# EAGLE design RPi_Keypad_Tester_01 (EAGLE 9.6.2)
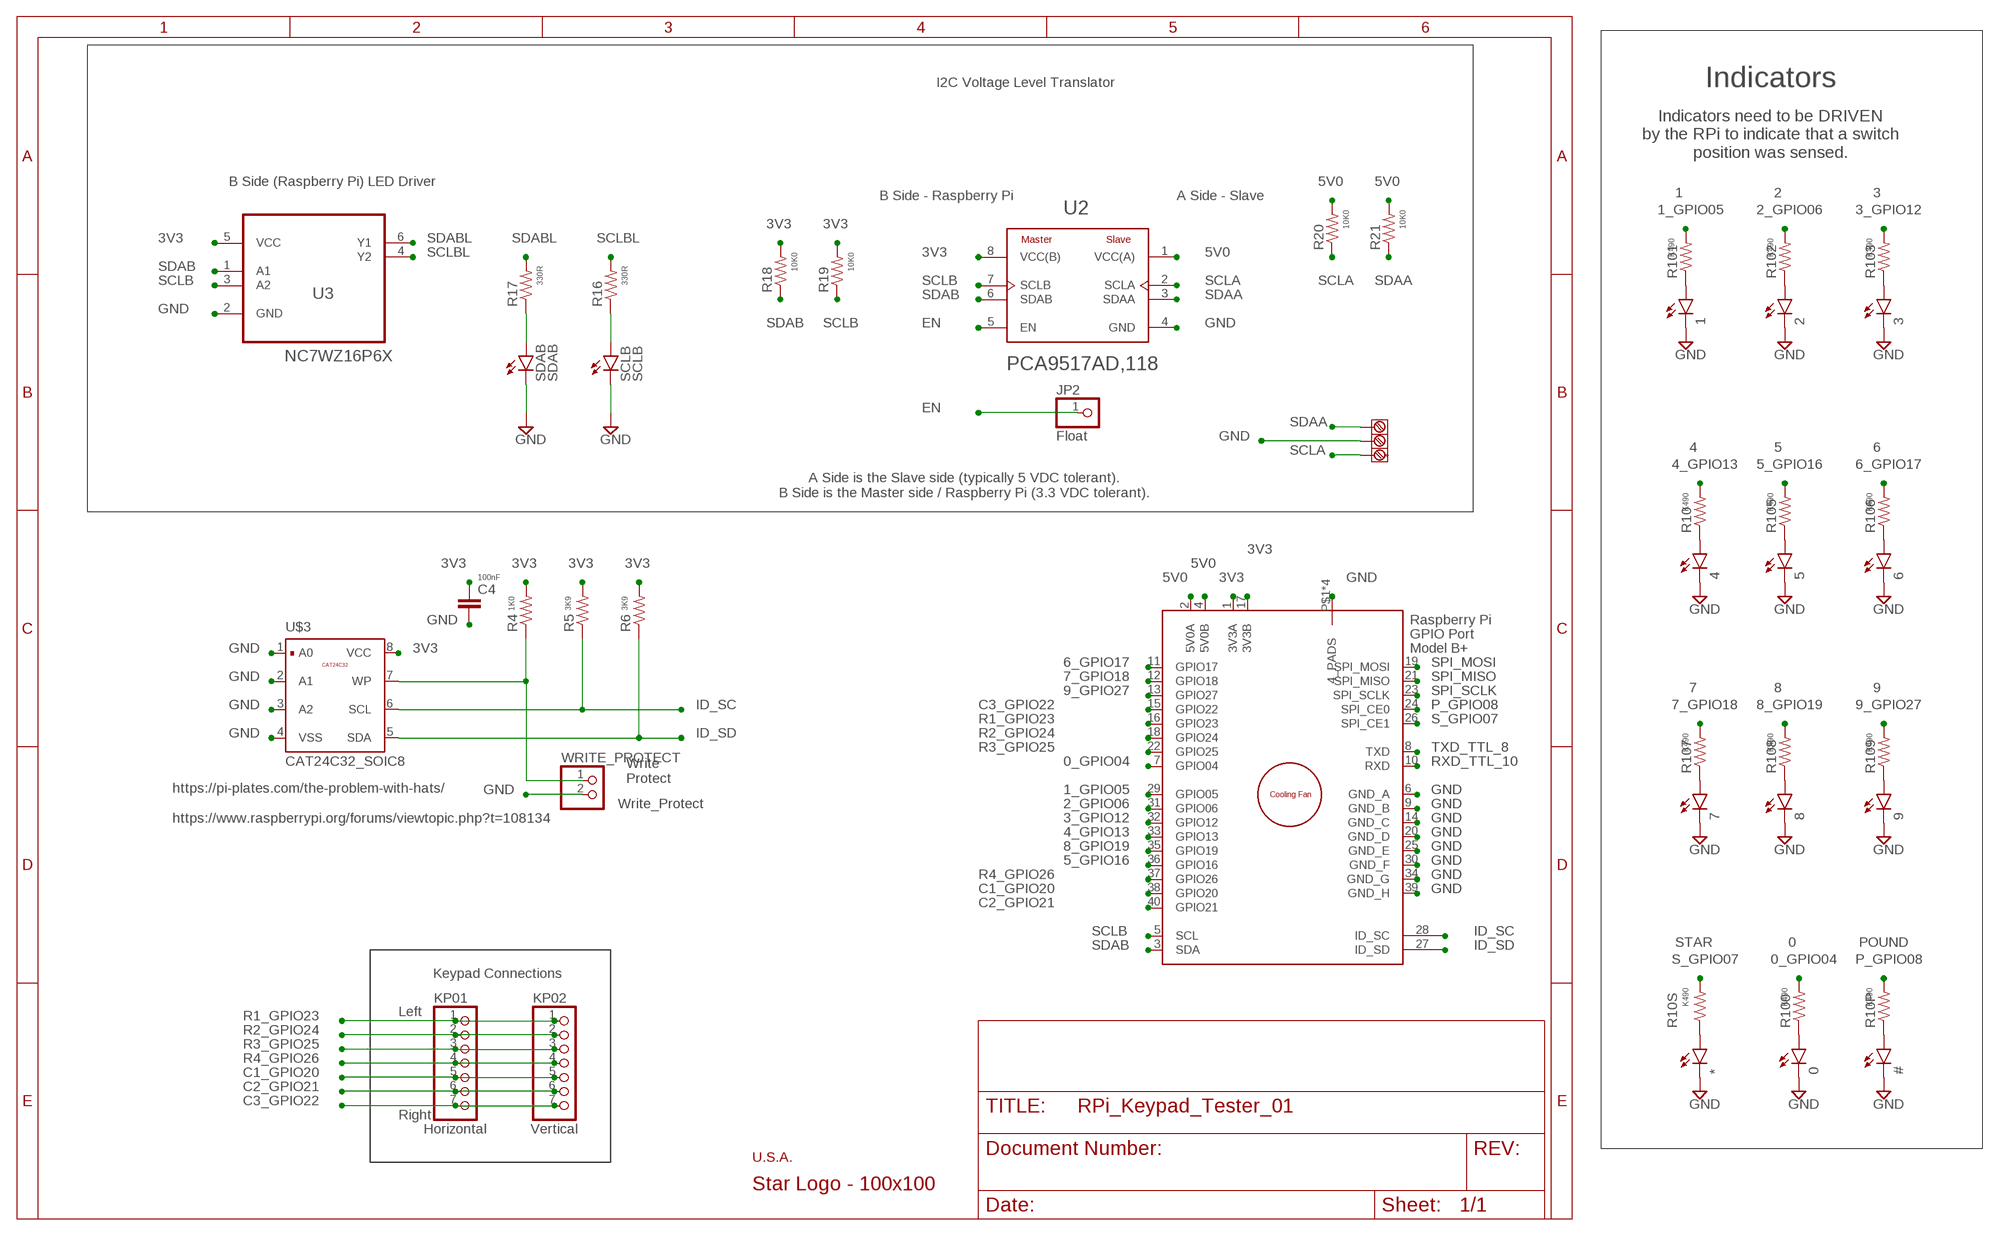
[diagram p0: schematic, sheet 1]

## Parts
0  0  LEDSML1206  [SML1206]
1  1  LEDSML1206  [SML1206]
2  2  LEDSML1206  [SML1206]
3  3  LEDSML1206  [SML1206]
4  4  LEDSML1206  [SML1206]
5  5  LEDSML1206  [SML1206]
6  6  LEDSML1206  [SML1206]
7  7  LEDSML1206  [SML1206]
8  8  LEDSML1206  [SML1206]
9  9  LEDSML1206  [SML1206]
#  POUND  LEDSML1206  [SML1206]
*  STAR  LEDSML1206  [SML1206]
C4  100nF  C0805C0805  [C0805]
JP2  Float  PINHD-1X1  [1X01]
KP01  PINHD-1X7/90  [1X07/90]
KP02  PINHD-1X7  [1X07]
R4  1K0  RESISTOR_1206_AC  [RES_1206]
R5  3K9  RESISTOR_1206_AC  [RES_1206]
R6  3K9  RESISTOR_1206_AC  [RES_1206]
R10  K490  RESISTOR_1206_AC  [RES_1206]
R10P  K490  RESISTOR_1206_AC  [RES_1206]
R10S  K490  RESISTOR_1206_AC  [RES_1206]
R16  330R  RESISTOR_1206_AC  [RES_1206]
R17  330R  RESISTOR_1206_AC  [RES_1206]
R18  10K0  RESISTOR_1206_AC  [RES_1206]
R19  10K0  RESISTOR_1206_AC  [RES_1206]
R20  10K0  RESISTOR_1206_AC  [RES_1206]
R21  10K0  RESISTOR_1206_AC  [RES_1206]
R100  K490  RESISTOR_1206_AC  [RES_1206]
R101  K490  RESISTOR_1206_AC  [RES_1206]
R102  K490  RESISTOR_1206_AC  [RES_1206]
R103  K490  RESISTOR_1206_AC  [RES_1206]
R105  K490  RESISTOR_1206_AC  [RES_1206]
R106  K490  RESISTOR_1206_AC  [RES_1206]
R107  K490  RESISTOR_1206_AC  [RES_1206]
R108  K490  RESISTOR_1206_AC  [RES_1206]
R109  K490  RESISTOR_1206_AC  [RES_1206]
SCLB  SCLB  LEDSML1206  [SML1206]
SDAB  SDAB  LEDSML1206  [SML1206]
U2  PCA9517AD,118  [SOIC127P600X175-8N]
U3  NC7WZ16P6X  [SOT65P210X110-6N]
U$1  USA_01  [USA_01]
U$2  3_POSITION_3.81  [3_POSITION_3.81]
U$3  CAT24C32_SOIC8  [CAT24C32_SOIC8]
U$4  STAR_LOGO_01  [STAR_LOGO_01]
WRITE_PROTECT  Write_Protect  PINHD-1X2  [1X02]
X1  RASPI_BOARD_B+#2_HDC  [RASPI_BOARD_B+HAT_DF_CF]

## Nets
0_GPIO04: R100.2 X1.7(GPIO04)
1_GPIO05: R101.2 X1.29(GPIO05)
2_GPIO06: R102.2 X1.31(GPIO06)
3_GPIO12: R103.2 X1.32(GPIO12)
3V3: C4.1 R4.2 R5.2 R6.2 R18.2 R19.2 U2.8(VCC(B)) U3.5(VCC) U$3.8(VCC) X1.1(3V3A) X1.17(3V3B)
4_GPIO13: R10.2 X1.33(GPIO13)
5_GPIO16: R105.2 X1.36(GPIO16)
5V0: R20.2 R21.2 U2.1(VCC(A)) X1.2(5V0A) X1.4(5V0B)
6_GPIO17: R106.2 X1.11(GPIO17)
7_GPIO18: R107.2 X1.12(GPIO18)
8_GPIO19: R108.2 X1.35(GPIO19)
9_GPIO27: R109.2 X1.13(GPIO27)
C1_GPIO20: KP01.5 KP02.5 X1.38(GPIO20)
C2_GPIO21: KP01.6 KP02.6 X1.40(GPIO21)
C3_GPIO22: KP01.7 KP02.7 X1.15(GPIO22)
EN: JP2.1 U2.5(EN)
GND: 0.C 1.C 2.C 3.C 4.C 5.C 6.C 7.C 8.C 9.C #.C *.C C4.2 SCLB.C SDAB.C U2.4(GND) U3.2(GND) U$2.2 U$3.1(A0) U$3.2(A1) U$3.3(A2) U$3.4(VSS) WRITE_PROTECT.2 X1.6(GND_A) X1.9(GND_B) X1.14(GND_C) X1.20(GND_D) X1.25(GND_E) X1.30(GND_F) X1.34(GND_G) X1.39(GND_H) X1.P$1(4_PADS) X1.P$2(4_PADS) X1.P$3(4_PADS) X1.P$4(4_PADS)
ID_SC: R5.1 U$3.6(SCL) X1.28(ID_SC)
ID_SD: R6.1 U$3.5(SDA) X1.27(ID_SD)
ID_WP1: R4.1 U$3.7(WP) WRITE_PROTECT.1
N$1: 1.A R101.1
N$2: 2.A R102.1
N$3: 3.A R103.1
N$4: 4.A R10.1
N$5: 5.A R105.1
N$6: 6.A R106.1
N$7: 7.A R107.1
N$8: 8.A R108.1
N$9: 9.A R109.1
N$10: *.A R10S.1
N$11: 0.A R100.1
N$12: #.A R10P.1
N$13: R16.1 SCLB.A
N$14: R17.1 SDAB.A
P_GPIO08: R10P.2 X1.24(SPI_CE0)
R1_GPIO23: KP01.1 KP02.1 X1.16(GPIO23)
R2_GPIO24: KP01.2 KP02.2 X1.18(GPIO24)
R3_GPIO25: KP01.3 KP02.3 X1.22(GPIO25)
R4_GPIO26: KP01.4 KP02.4 X1.37(GPIO26)
RXD_TTL_10: X1.10(RXD)
S_GPIO07: R10S.2 X1.26(SPI_CE1)
SCLA: R20.1 U2.2(SCLA) U$2.1
SCLB: R19.1 U2.7(SCLB) U3.3(A2) X1.5(SCL)
SCLBL: R16.2 U3.4(Y2)
SDAA: R21.1 U2.3(SDAA) U$2.3
SDAB: R18.1 U2.6(SDAB) U3.1(A1) X1.3(SDA)
SDABL: R17.2 U3.6(Y1)
SPI_MISO: X1.21(SPI_MISO)
SPI_MOSI: X1.19(SPI_MOSI)
SPI_SCLK: X1.23(SPI_SCLK)
TXD_TTL_8: X1.8(TXD)

## Notes on the sheet
- I2C Voltage Level Translator | Indicators
- Indicators need to be DRIVEN
  by the RPi to indicate that a switch
  position was sensed.
- B Side (Raspberry Pi) LED Driver
- B Side - Raspberry Pi | A Side - Slave
- A Side is the Slave side (typically 5 VDC tolerant).
  B Side is the Master side / Raspberry Pi (3.3 VDC tolerant).
- Write
  Protect
- https://pi-plates.com/the-problem-with-hats/
  
  https://www.raspberrypi.org/forums/viewtopic.php?t=108134
- Keypad Connections
- Left
- Right
- Horizontal | Vertical

## Library data of the parts
0 1-9 # * SCLB SDAB = RPi_Keypad_Tester:LED: LED OSRAM: - CHIPLED LG R971, LG N971, LY N971, LG Q971, LY Q971, LO R971, LY R971 LH N974, LH R974 LS Q976, LO Q976, LY Q976 LO Q996 - Hyper CHIPLED LW Q18S LB Q993, LB Q99A, LB R99A - SideLED LS A670, LO A670, LY A670, LG A670, LP A670 LB A673, LV A673, LT A673, LW A673 LH A674 LY A675 LS A676, LA A676, LO A676, LY A676, LW A676 LS A679, LY A679, LG A679 - Hyper Micro SIDELED® LS Y876, LA Y876, LO Y876, LY Y876 LT Y87S - SmartLED LW L88C, LW L88S LB L89C, LB L89S, LG L890 LS L89K, LO L89K, LY L89K LS L896, LA L896, LO L896, LY L896 - TOPLED LS T670, LO T670, LY T670, LG T670, LP T670 LSG T670, LSP T670, LSY T670, LOP T670, LYG T670 LG T671, LOG T671, LSG T671 LB T673, LV T673, LT T673, LW T673 LH T674 LS T676, LA T676, LO T676, LY T676, LB T676, LH T676, LSB T676, LW T676 LB T67C, LV T67C, LT T67C, LS T67K, LO T67K, LY T67K, LW E67C LS E67B, LA E67B, LO E67B, LY E67B, LB E67C, LV E67C, LT E67C LW T67C LS T679, LY T679, LG T679 LS T770, LO T770, LY T770, LG T770, LP T770 LB T773, LV T773, LT T773, LW T773 LH T774 LS E675, LA E675, LY E675, LS T675 LS T776, LA T776, LO T776, LY T776, LB T776 LHGB T686 LT T68C, LB T68C - Hyper Mini TOPLED® LB M676 - Mini TOPLED Santana® LG M470 LS M47K, LO M47K, LY M47K Source: http://www.osram.convergy.de LUXEON: - LUMILED® LXK2-PW12-R00, LXK2-PW12-S00, LXK2-PW14-U00, LXK2-PW14-V00 LXK2-PM12-R00, LXK2-PM12-S00, LXK2-PM14-U00 LXK2-PE12-Q00, LXK2-PE12-R00, LXK2-PE12-S00, LXK2-PE14-T00, LXK2-PE14-U00 LXK2-PB12-K00, LXK2-PB12-L00, LXK2-PB12-M00, LXK2-PB14-N00, LXK2-PB14-P00, LXK2-PB14-Q00 LXK2-PR12-L00, LXK2-PR12-M00, LXK2-PR14-Q00, LXK2-PR14-R00 LXK2-PD12-Q00, LXK2-PD12-R00, LXK2-PD12-S00 LXK2-PH12-R00, LXK2-PH12-S00 LXK2-PL12-P00, LXK2-PL12-Q00, LXK2-PL12-R00 Source: www.luxeon.com KINGBRIGHT: KA-3528ASYC Source: www.kingbright.com
C4 = RPi_Keypad_Tester:C0805: CAPACITOR, European symbol; SPICEPREFIX: C
JP2 = RPi_Keypad_Tester:PINHD-1X1: PIN HEADER
KP01 KP02 = RPi_Keypad_Tester:PINHD-1X7: PIN HEADER
R4-R6 R10 R10P R10S R16-R21 R100-R103 R105-R109 = RPi_Keypad_Tester:RESISTOR_1206_AC: RES 0.05 OHM 1% 1W 1206 Manufacturer's datasheet <http://www.vishay.com/docs/30122/wslp.pdf>; CREATED_BY: PCBLayout.com; DIGIKEY_PART_NUMBER: WSLP-.05TR-ND; MANUFACTURER: Vishay Dale; MPN: WSLP1206R0500FEA; PACKAGE: SMD 1206
U2 = RPi_Keypad_Tester:PCA9517AD,118: PCA9517A Series 2.7 V to 5.5 V Level Translating I2C-Bus Repeater - SOIC - 8 Check prices <https://pricing.snapeda.com/parts/PCA9517AD%2C118/NXP%20USA/view-part?ref=eda>; AVAILABILITY: Good; DESCRIPTION: Buffer, ReDriver 2 Channel 400kHz 8-SO; MF: NXP USA; MP: PCA9517AD,118; PACKAGE: SO-8 NXP Semiconductors; PRICE: None; PURCHASE-URL: https://pricing.snapeda.com/search/part/PCA9517AD,118/?ref=eda
U3 = RPi_Keypad_Tester:NC7WZ16P6X: Dual Buffer Check prices <https://pricing.snapeda.com/parts/NC7WZ16P6X/ON%20Semiconductor/view-part?ref=eda>; AVAILABILITY: Good; DESCRIPTION: Buffer, Non-Inverting 2 Element 1 Bit per Element Push-Pull Output SC-88 (SC-70-6); MF: ON Semiconductor; MP: NC7WZ16P6X; PACKAGE: SC-88-6 ON Semiconductor; PRICE: None; PURCHASE-URL: https://pricing.snapeda.com/search/part/NC7WZ16P6X/?ref=eda
U$1 = RPi_Keypad_Tester:USA_01: DEVICE- U.S.A. Flag
U$2 = RPi_Keypad_Tester:3_POSITION_3.81: DEVICE - 3 Position PCB Connector - 3.81 mm Spacing
U$3 = RPi_Keypad_Tester:CAT24C32_SOIC8
U$4 = RPi_Keypad_Tester:STAR_LOGO_01
WRITE_PROTECT = RPi_Keypad_Tester:PINHD-1X2: PIN HEADER
X1 = RPi_Keypad_Tester:RASPI_BOARD_B+#2: Raspberry Pi GPIO connector with markings for the outer dimensions of the Raspberry Pi board model B+ with different sets of drill holes or mounting pads All pins connected

## Board
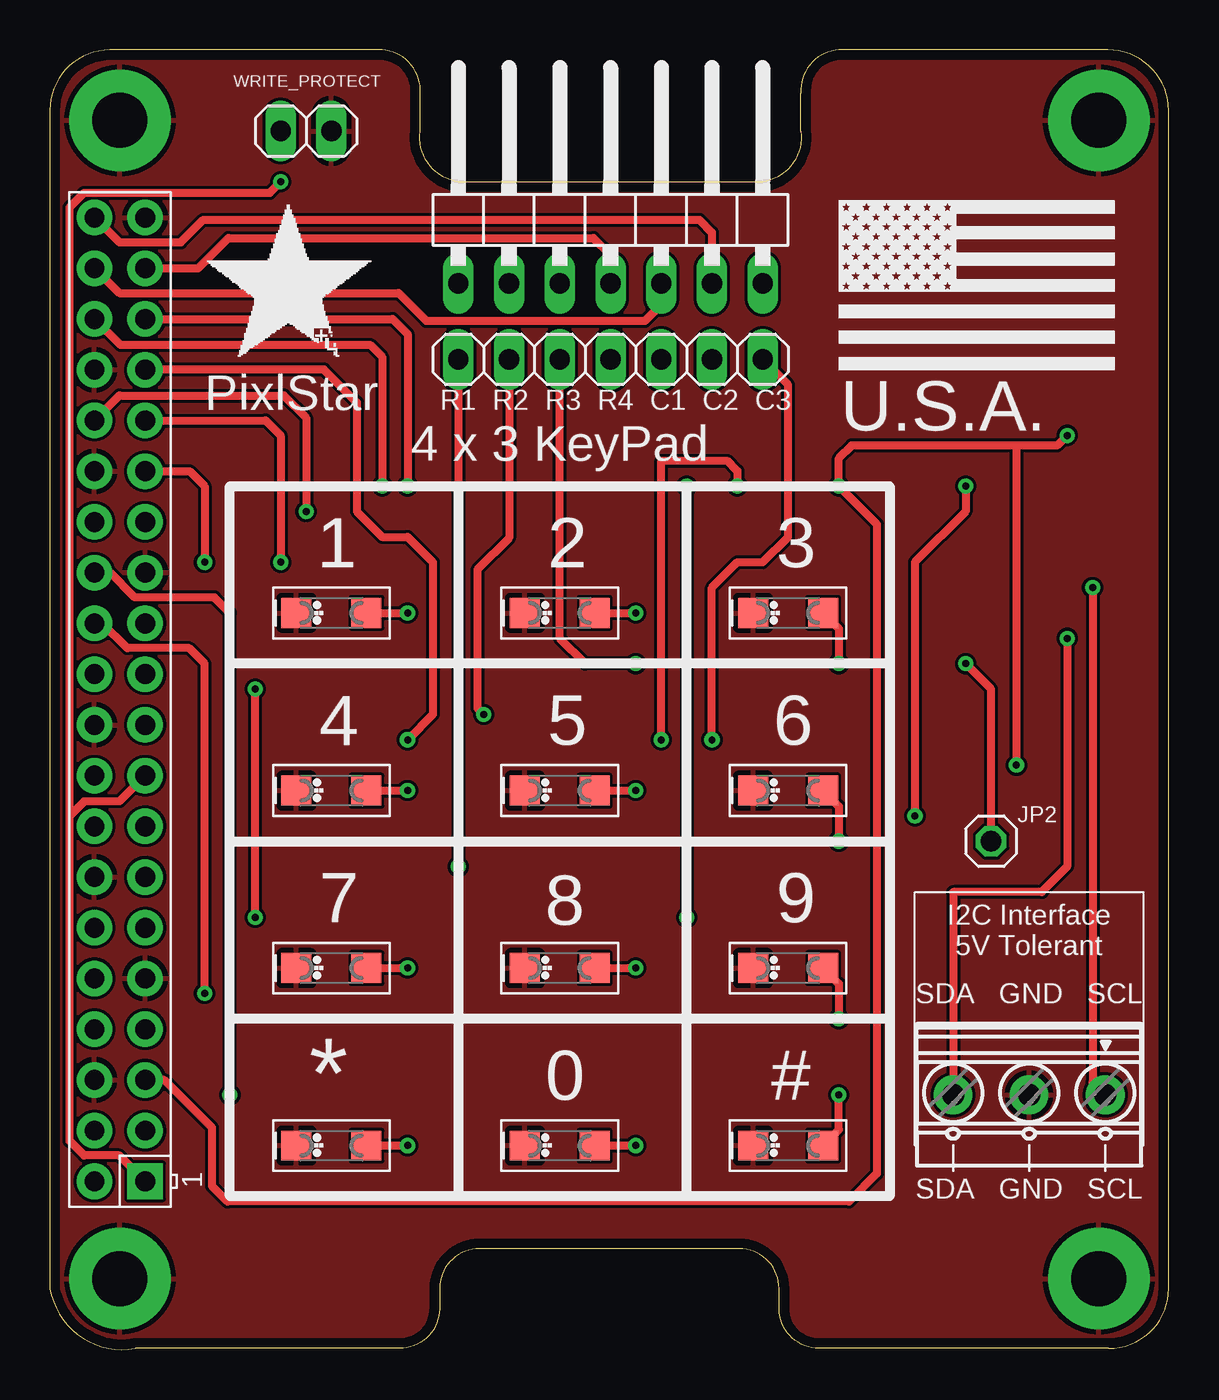
[diagram p1: board, top side]
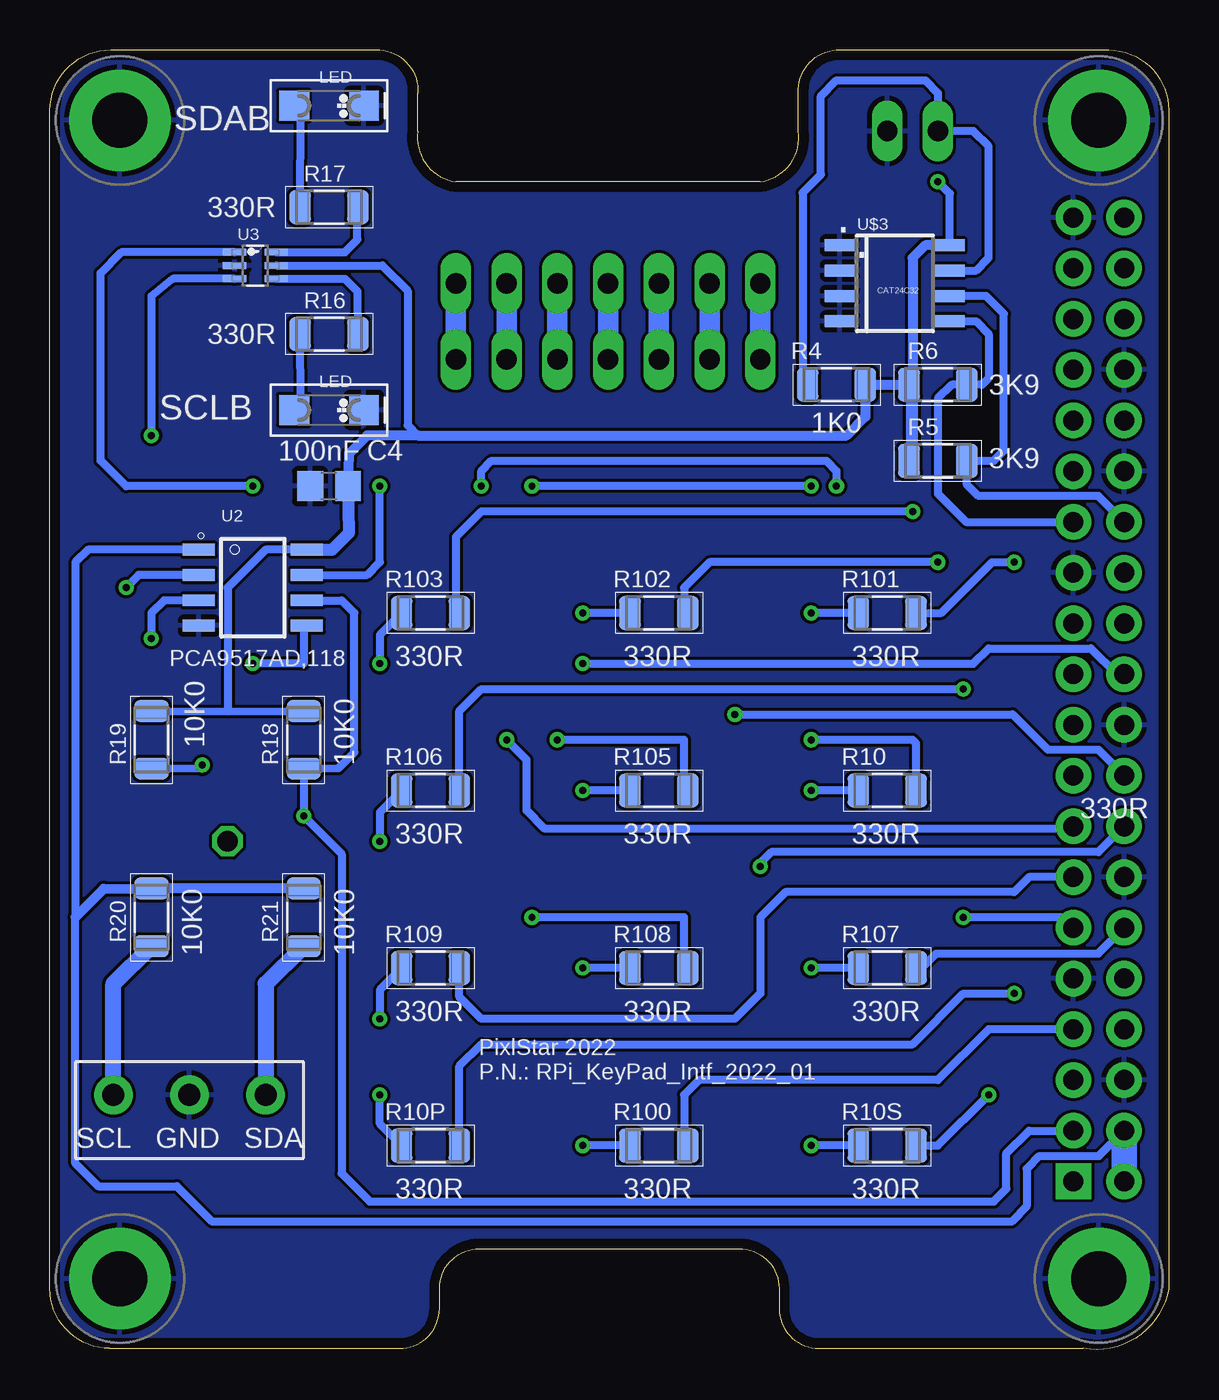
[diagram p2: board, bottom side, seen from below]

Size 56 x 65.08 mm. Coordinates in mm from the lower left corner, seen from the top.
Copper layers (1*16): Top 0.035mm / dielectric 1.5mm / Bottom 0.035mm
Design rules "default *": minimum track width 6mil, minimum drill 0.35mm, track to track 6mil, track to pad 6mil, pad to pad 6mil, via to via 6mil, smd to smd 6mil, copper to edge 20mil, drill to drill 6mil, minimum pad ring 10mil, minimum via ring 8mil, stop-mask expansion 4mil, vias tented up to drill 0mil, thermal gap 10mil

### Footprints (pad centres in the part's own frame; a part is rotated, then mirrored left to right if it is on the bottom)
SML1206 = smd 1.5 x 1.5: A 1.75,0; C -1.75,0
C0805 = smd 1.3 x 1.5: 1 -0.95,0; 2 0.95,0
1X01 = drill 1.016 octagon: 1 0,0
1X07/90 = drill 1.016 long: 1 -7.62,-3.81; 2 -5.08,-3.81; 3 -2.54,-3.81; 4 0,-3.81; 5 2.54,-3.81; 6 5.08,-3.81; 7 7.62,-3.81
1X07 = drill 1.016 long: 1 -7.62,0; 2 -5.08,0; 3 -2.54,0; 4 0,0; 5 2.54,0; 6 5.08,0; 7 7.62,0
RES_1206 = smd 1.08 x 1.68: 1 -1.445,0; 2 1.445,0
SOIC127P600X175-8N = smd 1.6 x 0.6: 1 -2.7,1.905; 2 -2.7,0.635; 3 -2.7,-0.635; 4 -2.7,-1.905; 5 2.7,-1.905; 6 2.7,-0.635; 7 2.7,0.635; 8 2.7,1.905
SOT65P210X110-6N = smd 1.168 x 0.356: 1 -1.041,0.66; 2 -1.041,0; 3 -1.041,-0.66; 4 1.041,-0.66; 5 1.041,0; 6 1.041,0.66
3_POSITION_3.81 = drill 1.1 pad 1.93: 1 -5.715,0; 2 -1.905,0; 3 1.905,0
CAT24C32_SOIC8 = smd 1.5 x 0.6: 1 -2.75,1.905; 2 -2.75,0.635; 3 -2.75,-0.635; 4 -2.75,-1.905; 5 2.75,-1.905; 6 2.75,-0.635; 7 2.75,0.635; 8 2.75,1.905
1X02 = drill 1.016 long: 1 -1.27,0; 2 1.27,0
RASPI_BOARD_B+HAT_DF_CF = drill 1 pad 1.778 square: 1 8.37,51.23 | drill 1 pad 1.778: 2 8.37,53.77; 3 10.91,51.23; 4 10.91,53.77; 5 13.45,51.23; 6 13.45,53.77; 7 15.99,51.23; 8 15.99,53.77; 9 18.53,51.23; 10 18.53,53.77; 11 21.07,51.23; 12 21.07,53.77; 13 23.61,51.23; 14 23.61,53.77; 15 26.15,51.23; 16 26.15,53.77; 17 28.69,51.23; 18 28.69,53.77; 19 31.23,51.23; 20 31.23,53.77; 21 33.77,51.23; 22 33.77,53.77; 23 36.31,51.23; 24 36.31,53.77; 25 38.85,51.23; 26 38.85,53.77; 27 41.39,51.23; 28 41.39,53.77; 29 43.93,51.23; 30 43.93,53.77; 31 46.47,51.23; 32 46.47,53.77; 33 49.01,51.23; 34 49.01,53.77; 35 51.55,51.23; 36 51.55,53.77; 37 54.09,51.23; 38 54.09,53.77; 39 56.63,51.23; 40 56.63,53.77 | drill 2.75 pad 5.08: P$1 3.5,52.502; P$2 61.5,52.5; P$3 3.5,3.5; P$4 61.5,3.5

### Placement (x,y rotation side)
0  25.52,10.21 0 top
1  14.09,36.88 0 top
2  25.52,36.88 0 top
3  36.95,36.88 0 top
4  14.09,27.99 0 top
5  25.52,27.99 0 top
6  36.95,27.99 0 top
7  14.09,19.1 0 top
8  25.52,19.1 0 top
9  36.95,19.1 0 top
#  36.95,10.21 0 top
*  14.09,10.21 0 top
C4  42.03,43.23 180 bottom
JP2  47.11,25.45 0 top
KP01  28.06,57.2 0 top
KP02  28.06,49.58 0 top
R4  16.63,48.31 0 bottom
R5  11.55,44.5 180 bottom
R6  11.55,48.31 180 bottom
R10  14.09,27.99 0 bottom
R10P  36.95,10.21 0 bottom
R10S  14.09,10.21 0 bottom
R16  42.03,50.85 0 bottom
R17  42.03,57.2 0 bottom
R18  43.3,30.53 90 bottom
R19  50.92,30.53 90 bottom
R20  50.92,21.64 90 bottom
R21  43.3,21.64 90 bottom
R100  25.52,10.21 0 bottom
R101  14.09,36.88 0 bottom
R102  25.52,36.88 0 bottom
R103  36.95,36.88 0 bottom
R105  25.52,27.99 0 bottom
R106  36.95,27.99 0 bottom
R107  14.09,19.1 0 bottom
R108  25.52,19.1 0 bottom
R109  36.95,19.1 0 bottom
SCLB  42.03,47.04 180 bottom
SDAB  42.03,62.28 180 bottom
U2  45.84,38.15 0 bottom
U3  45.71,54.28 0 bottom
U$1  39.36,48.95 0 top
U$2  47.11,12.75 180 top
U$3  13.71,53.39 0 bottom
U$4  7.74,49.58 0 top
WRITE_PROTECT  12.82,61.01 0 top
X1  56,0.05 90 top

### Tracks (layer width: path | path; a pad name or v marks a point on that pad's centre or on a via)
0_GPIO04
  Bottom 0.406: R100.2 24.25,10.39 24.25,12.75 23.5,13.5 11.55,13.5 9.01,16.04 X1.7
1_GPIO05  (via drill 0.35)
  Top 0.406: X1.29 6.99,43.98 7.74,43.23 v7.74,39.42
  Bottom 0.406: R101.2 11.38,36.88 8.83,39.42 v7.74,39.42
2_GPIO06  (via drill 0.35)
  Top 0.406: X1.31 10.8,46.52 11.55,45.77 v11.55,39.42
  Bottom 0.406: v11.55,39.42 22.98,39.42 24.25,38.15 24.25,37.06 R102.2
3_GPIO12  (via drill 0.35)
  Top 0.406: X1.32 3.47,47.77 11.71,47.77 12.82,46.66 v12.82,41.96
  Bottom 0.406: v12.82,41.96 34.41,41.96 35.68,40.69 35.68,37.06 R103.2
3V3  (via drill 0.35)
  Top 0.406: X1.1 3.47,9.72 1.71,9.72 0.98,10.45 0.98,26.72 | 0.98,26.72 0.98,57.2 1.71,57.93 11,57.93 v11.55,58.47 | 0.98,26.72 0.99,26.72 1.71,27.45 3.47,27.45 X1.17
  Bottom 0.406: U$3.8 10.96,57.88 v11.55,58.47 | R19.2 47.11,31.96 | 47.11,31.96 R18.2 | U2.8 45.2,40.06 47.11,38.15 47.11,31.96 | U3.5 39.36,54.28 38.09,53.01 38.09,46.28 37.59,45.77
  Bottom 0.508: C4.1 41.03,44.87 40.12,45.77 37.59,45.77 16.12,45.77 15.18,46.71 R4.2 R6.2 12.82,48.31 12.82,54.66 12.18,55.3 U$3.8
  Bottom 0.61: U2.8 41.87,40.06 41.03,40.9 C4.1 | R6.2 12.87,48.19 12.87,44.63 R5.2
4_GPIO13  (via drill 0.35)
  Top 0.406: X1.33 4.78,49.08 13.71,49.08 15.36,47.43 15.36,41.96 16.63,40.69 17.9,40.69 19.17,39.42 19.17,31.8 v17.9,30.53
  Bottom 0.406: R10.2 12.64,30.36 12.82,30.53 v17.9,30.53
5_GPIO16  (via drill 0.35)
  Top 0.406: X1.36 3.52,50.31 16.03,50.31 16.63,49.71 v16.63,43.23 | v30.6,30.53 30.6,44.5 33.9,44.5 34.41,44 v34.41,43.23
  Bottom 0.406: R105.2 24.25,28.17 24.25,30.53 v30.6,30.53 | v34.41,43.23 34.41,44 33.9,44.5 17.14,44.5 16.63,44 v16.63,43.23
5V0
  Bottom 0.406: X1.4 3.5,9.69 6.47,9.69 7.1,9.06 7.1,7.17 7.87,6.4 47.87,6.4 49.65,8.18 53.59,8.18 54.73,9.33 54.73,21.64 54.73,39.42 54.09,40.06 U2.1
  Bottom 0.508: 54.73,21.64 53.31,23.07 R20.2 R21.2
  Bottom 1.27: X1.2 X1.4
6_GPIO17  (via drill 0.35)
  Top 0.406: v10.28,21.64 v10.28,33.07
  Bottom 0.406: R106.2 35.5,31.98 34.41,33.07 v10.28,33.07 | X1.11 5.29,21.64 v10.28,21.64
7_GPIO18
  Bottom 0.406: R107.2 12.36,19.1 11.64,19.83 3.52,19.83 X1.12
8_GPIO19  (via drill 0.35)
  Top 0.406: v17.9,43.23 17.9,50.85 17.15,51.6 X1.35 | v31.87,43.23 v31.87,21.64
  Bottom 0.406: v17.9,43.23 v31.87,43.23 | R108.2 24.25,19.28 24.25,21.64 v31.87,21.64
9_GPIO27
  Bottom 0.406: X1.13 6.99,23.66 7.74,22.91 19.17,22.91 20.44,21.64 20.44,17.83 21.71,16.56 34.41,16.56 35.5,17.66 R109.2
C1_GPIO20
  Top 0.406: KP01.5 30.6,52.32 29.79,51.51 18.83,51.51 17.45,52.9 3.47,52.9 X1.38
  Bottom 1.016: KP02.5 KP01.5
C2_GPIO21
  Top 0.406: X1.40 3.47,55.44 6.56,55.44 7.68,56.57 32.5,56.57 33.14,55.93 KP01.6
  Bottom 1.016: KP02.6 KP01.6
C3_GPIO22  (via drill 0.35)
  Top 0.406: v33.14,30.53 33.14,38.15 34.41,39.42 35.68,39.42 36.95,40.69 36.95,48.31 KP02.7
  Bottom 0.406: X1.15 4.9,26.08 31.22,26.08 32.14,26.99 32.14,29.53 v33.14,30.53
  Bottom 1.016: KP02.7 KP01.7
EN  (via drill 0.35)
  Top 0.406: JP2.1 47.11,33.07 v45.84,34.34
  Bottom 0.406: U2.5 43.3,36.09 43.3,34.34 v45.84,34.34
GND
  pour Top: -2.42,67.36 58.54,67.36 58.54,-2.49 -2.42,-2.49
  pour Bottom: -4.96,68.63 61.08,68.63 61.08,-5.03 -4.96,-5.03
ID_SC
  Bottom 0.406: U$3.6 9.14,52.76 8.25,51.87 8.25,45.01 8.76,44.5 R5.1 10.1,43.31 9.53,42.74 3.52,42.74 X1.28
ID_SD
  Bottom 0.406: U$3.5 9.64,51.49 9.01,50.85 9.01,48.65 9.34,48.31 R6.1 10.87,48.31 11.55,47.63 11.55,42.85 10.14,41.44 X1.27
ID_WP1
  Bottom 0.406: U$3.7 9.64,54.03 9.01,54.66 9.01,60.25 9.77,61.01 WRITE_PROTECT.1 11.55,62.92 12.18,63.55 16.63,63.55 17.41,62.77 17.41,58.84 18.33,57.92 18.33,48.57 R4.1
N$1  (via drill 0.35)
  Top 0.406: 1.A v17.9,36.88
  Bottom 0.406: R101.1 v17.9,36.88
N$2  (via drill 0.35)
  Top 0.406: 2.A v29.33,36.88
  Bottom 0.406: R102.1 v29.33,36.88
N$3  (via drill 0.35)
  Top 0.406: 3.A 39.49,36.09 v39.49,34.34
  Bottom 0.406: R103.1 39.49,35.79 v39.49,34.34
N$4  (via drill 0.35)
  Top 0.406: 4.A v17.9,27.99
  Bottom 0.406: R10.1 v17.9,27.99
N$5  (via drill 0.35)
  Top 0.406: 5.A v29.33,27.99
  Bottom 0.406: R105.1 v29.33,27.99
N$6  (via drill 0.35)
  Top 0.406: 6.A 39.49,27.2 v39.49,25.45
  Bottom 0.406: R106.1 39.49,26.9 v39.49,25.45
N$7  (via drill 0.35)
  Top 0.406: 7.A v17.9,19.1
  Bottom 0.406: R107.1 v17.9,19.1
N$8  (via drill 0.35)
  Top 0.406: 8.A v29.33,19.1
  Bottom 0.406: R108.1 v29.33,19.1
N$9  (via drill 0.35)
  Top 0.406: 9.A 39.49,18.31 v39.49,16.56
  Bottom 0.406: R109.1 39.49,18.01 v39.49,16.56
N$10  (via drill 0.35)
  Top 0.406: *.A v17.9,10.21
  Bottom 0.406: R10S.1 v17.9,10.21
N$11  (via drill 0.35)
  Top 0.406: 0.A v29.33,10.21
  Bottom 0.406: R100.1 v29.33,10.21
N$12  (via drill 0.35)
  Top 0.406: #.A 39.49,11 v39.49,12.75
  Bottom 0.406: R10P.1 39.49,11.31 v39.49,12.75
N$13
  Bottom 0.406: SCLB.A 43.45,47.37 R16.1
N$14
  Bottom 0.406: R17.1 43.45,61.96 SDAB.A
P_GPIO08  (via drill 0.35)
  Top 0.406: v7.74,17.83 7.74,34.34 6.96,35.12 3.87,35.12 2.63,36.36 X1.24
  Bottom 0.406: R10P.2 35.5,14.2 34.41,15.29 12.82,15.29 10.28,17.83 v7.74,17.83
R1_GPIO23  (via drill 0.35)
  Top 0.406: KP02.1 v20.44,24.18
  Bottom 0.406: v20.44,24.18 20.44,24.36 19.89,24.91 3.52,24.91 X1.16
  Bottom 1.016: KP02.1 KP01.1
R2_GPIO24  (via drill 0.35)
  Top 0.406: KP02.2 22.98,40.64 21.39,39.05 21.39,32.12 v21.71,31.8
  Bottom 0.406: X1.18 3.52,30.04 6.05,30.04 7.81,31.8 v21.71,31.8
  Bottom 1.016: KP02.2 KP01.2
R3_GPIO25  (via drill 0.35)
  Top 0.406: v29.33,34.34 26.79,34.34 25.52,35.61 KP02.3
  Bottom 0.406: X1.22 2.61,33.82 3.89,35.11 9.01,35.11 9.77,34.34 v29.33,34.34
  Bottom 1.016: KP02.3 KP01.3
R4_GPIO26
  Top 0.406: X1.37 7.42,54.14 8.93,55.66 27.2,55.66 28.06,54.79 KP01.4
  Bottom 1.016: KP02.4 KP01.4
S_GPIO07  (via drill 0.35)
  Top 0.406: v9.01,12.75 9.01,36.88 8.23,37.66 4.25,37.66 3.01,38.9 X1.26
  Bottom 0.406: R10S.2 11.55,10.21 v9.01,12.75
SCLA  (via drill 0.35)
  Top 0.406: v52.19,38.15 52.19,13.39 U$2.1
  Bottom 0.406: U2.2 51.55,38.79 v52.19,38.15
  Bottom 0.813: U$2.1 52.83,18.32 R20.1
SCLB  (via drill 0.35)
  Top 0.406: 48.38,45.27 40.12,45.27 39.49,44.63 v39.49,43.23 41.39,41.33 41.39,8.82 40,7.42 8.88,7.42 8.12,8.18 8.12,11.1 5.72,13.5 X1.5 | 48.38,45.27 v48.38,29.26 | v50.92,45.77 50.41,45.27 48.38,45.27
  Bottom 0.406: U2.7 40.12,38.79 39.49,39.42 v39.49,43.23 | R19.1 48.53,29.11 v48.38,29.26 | U3.3 49.84,53.62 50.92,52.76 v50.92,45.77
SCLBL
  Bottom 0.406: U3.4 41.24,53.62 40.61,52.99 R16.2
SDAA  (via drill 0.35)
  Top 0.406: v50.92,35.61 50.92,24.18 49.65,22.91 45.2,22.91 U$2.3
  Bottom 0.406: U2.3 50.28,37.52 50.92,36.88 v50.92,35.61
  Bottom 0.813: R21.1 45.2,18.32 U$2.3
SDAB  (via drill 0.35)
  Top 0.406: v45.84,43.23 45.84,41.96 43.3,39.42 v43.3,26.72
  Bottom 0.406: U2.6 41.39,37.52 40.76,36.88 40.76,29.9 41.55,29.11 R18.1 v43.3,26.72 41.39,24.82 41.39,8.82 40,7.42 8.76,7.42 8.12,8.06 8.12,9.83 6.99,10.96 X1.3 | U3.1 52.42,54.94 53.46,53.9 53.46,44.5 52.19,43.23 v45.84,43.23
SDABL
  Bottom 0.406: U3.6 41.24,54.94 40.61,55.58 R17.2

### Text on the board
tPlace: PixlStar | R1 R2 R3 R4 C1 C2 C3 | 4 x 3 KeyPad | I2C Interface / 5V Tolerant | SDA GND SCL | SDA GND SCL
bPlace: LED | 330R | . | 330R | 3K9 | LED | 1K0 | 3K9 | 100nF | 330R | 330R | 330R | PCA9517AD,118 | 10K0 | 10K0 | 330R | 330R | 330R | 330R | 10K0 | 10K0 | 330R | 330R | 330R | PixlStar 2022 / P.N.: RPi_KeyPad_Intf_2022_01 | SCL GND SDA | 330R | 330R | 330R